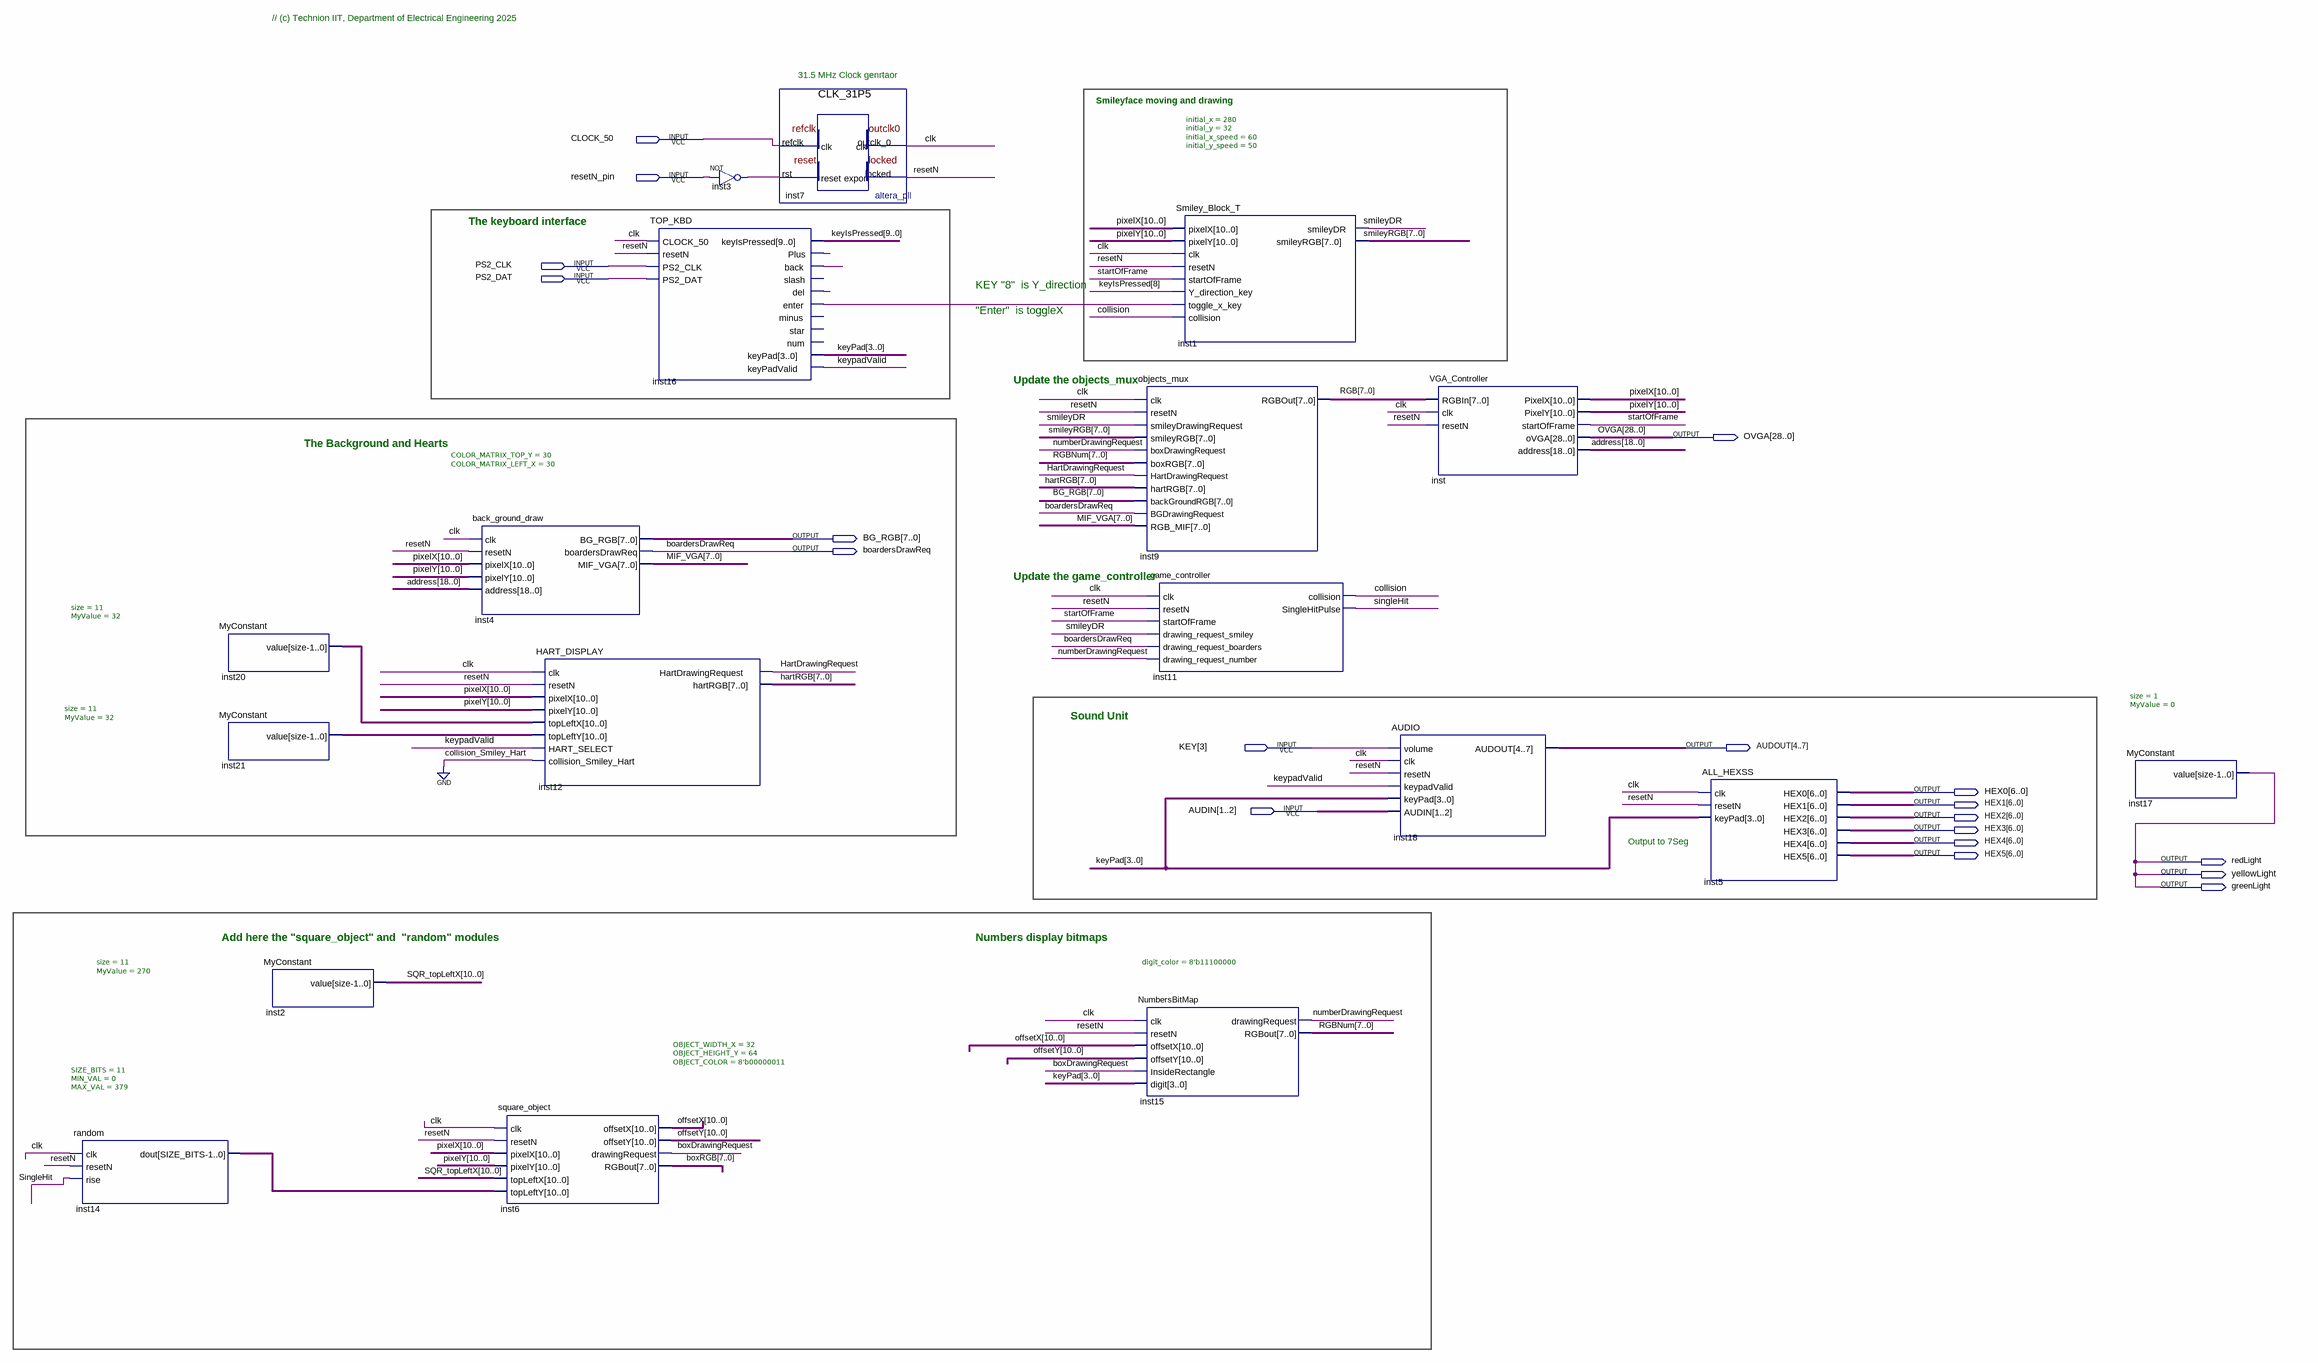
[diagram p0: schematic sheet]
// Quartus schematic TOP_VGA_DEMO.bdf as structural Verilog: 18 symbols, 19 pins
module TOP_VGA_DEMO (
  input  CLOCK_50,
  input  resetN_pin,
  input  PS2_CLK,
  input  PS2_DAT,
  input  [3:3] KEY,
  input  [1:2] AUDIN,
  output [28:0] OVGA,
  output [7:0] BG_RGB,
  output boardersDrawReq,
  output [4:7] AUDOUT,
  output [6:0] HEX0,
  output [6:0] HEX1,
  output [6:0] HEX2,
  output [6:0] HEX3,
  output [6:0] HEX4,
  output [6:0] HEX5,
  output redLight,
  output yellowLight,
  output greenLight
);

  wire boxDrawingRequest, clk, collision, HartDrawingRequest, inst3_out, inst16_back, inst16_del,
       inst16_enter, inst16_plus, keypadValid, numberDrawingRequest, resetN, singleHit, smileyDR,
       startOfFrame;
  wire [3:0] keyPad;
  wire [7:0] boxRGB, hartRGB, MIF_VGA, RGB, RGBNum, smileyRGB;
  wire [9:0] keyIsPressed;
  wire [10:0] inst14_dout, inst20_value, inst21_value, offsetX, offsetY, pixelX, pixelY, SQR_topLeftX;
  wire [18:0] address;

  random #(.SIZE_BITS(11), .MIN_VAL(0), .MAX_VAL(379)) inst14 (
    .clk(clk), .resetN(resetN), .rise(singleHit), .dout(inst14_dout));
  MyConstant #(.size(11), .MyValue(32)) inst20 (.value(inst20_value));
  MyConstant #(.size(11), .MyValue(32)) inst21 (.value(inst21_value));
  MyConstant #(.size(11), .MyValue(270)) inst2 (.value(SQR_topLeftX));
  back_ground_draw #(.COLOR_MATRIX_TOP_Y(30), .COLOR_MATRIX_LEFT_X(30)) inst4 (
    .clk(clk), .resetN(resetN), .pixelX(pixelX), .pixelY(pixelY), .address(address), .BG_RGB(BG_RGB),
    .boardersDrawReq(boardersDrawReq), .MIF_VGA(MIF_VGA));
  square_object #(.OBJECT_WIDTH_X(32), .OBJECT_HEIGHT_Y(64), .OBJECT_COLOR(8'b00000011)) inst6 (
    .clk(clk), .resetN(resetN), .pixelX(pixelX), .pixelY(pixelY), .topLeftX(SQR_topLeftX),
    .topLeftY(inst14_dout), .offsetX(offsetX), .offsetY(offsetY), .drawingRequest(boxDrawingRequest),
    .RGBout(boxRGB));
  HART_DISPLAY inst12 (
    .clk(clk), .resetN(resetN), .pixelX(pixelX), .pixelY(pixelY), .topLeftX(inst20_value),
    .topLeftY(inst21_value), .HART_SELECT(keypadValid), .collision_Smiley_Hart(1'b0),
    .HartDrawingRequest(HartDrawingRequest), .hartRGB(hartRGB));
  TOP_KBD inst16 (
    .CLOCK_50(clk), .resetN(resetN), .PS2_CLK(PS2_CLK), .PS2_DAT(PS2_DAT), .keyIsPressed(keyIsPressed),
    .Plus(inst16_plus), .back(inst16_back), .del(inst16_del), .enter(inst16_enter), .keyPad(keyPad),
    .keyPadValid(keypadValid));  // open: slash, minus, star, num
  not inst3 (inst3_out, resetN_pin);
  CLK_31P5 inst7 (.refclk(CLOCK_50), .rst(inst3_out), .outclk_0(clk), .locked(resetN));
  objects_mux inst9 (
    .clk(clk), .resetN(resetN), .smileyDrawingRequest(smileyDR), .smileyRGB(smileyRGB),
    .boxDrawingRequest(numberDrawingRequest), .boxRGB(RGBNum), .HartDrawingRequest(HartDrawingRequest),
    .hartRGB(hartRGB), .backGroundRGB(BG_RGB), .BGDrawingRequest(boardersDrawReq), .RGB_MIF(MIF_VGA),
    .RGBOut(RGB));
  game_controller inst11 (
    .clk(clk), .resetN(resetN), .startOfFrame(startOfFrame), .drawing_request_smiley(smileyDR),
    .drawing_request_boarders(boardersDrawReq), .drawing_request_number(numberDrawingRequest),
    .collision(collision), .SingleHitPulse(singleHit));
  NumbersBitMap #(.digit_color(8'b11100000)) inst15 (
    .clk(clk), .resetN(resetN), .offsetX(offsetX), .offsetY(offsetY), .InsideRectangle(boxDrawingRequest),
    .digit(keyPad), .drawingRequest(numberDrawingRequest), .RGBout(RGBNum));
  Smiley_Block_T #(.initial_x(280), .initial_y(32), .initial_x_speed(60), .initial_y_speed(50)) inst1 (
    .pixelX(pixelX), .pixelY(pixelY), .clk(clk), .resetN(resetN), .startOfFrame(startOfFrame),
    .Y_direction_key(keyIsPressed[8]), .toggle_x_key(inst16_enter), .collision(collision),
    .smileyDR(smileyDR), .smileyRGB(smileyRGB));
  AUDIO inst18 (
    .volume(KEY[3]), .clk(clk), .resetN(resetN), .keypadValid(keypadValid), .keyPad(keyPad), .AUDIN(AUDIN),
    .AUDOUT(AUDOUT));
  VGA_Controller inst (
    .RGBIn(RGB), .clk(clk), .resetN(resetN), .PixelX(pixelX), .PixelY(pixelY), .startOfFrame(startOfFrame),
    .oVGA(OVGA), .address(address));
  ALL_HEXSS inst5 (
    .clk(clk), .resetN(resetN), .keyPad(keyPad), .HEX0(HEX0), .HEX1(HEX1), .HEX2(HEX2), .HEX3(HEX3),
    .HEX4(HEX4), .HEX5(HEX5));
  MyConstant #(.size(1), .MyValue(0)) inst17 (.value(greenLight));

  assign redLight = greenLight;
  assign yellowLight = greenLight;

  // Notes on the sheet:
  //   // (c) Technion IIT, Department of Electrical Engineering 2025
  //   31.5 MHz Clock genrtaor
  //   Smileyface moving and drawing
  //   The keyboard interface
  //   KEY "8"  is Y_direction
  //   "Enter"  is toggleX
  //   Update the objects_mux
  //   The Background and Hearts
  //   Update the game_controller
  //   Sound Unit
  //   Output to 7Seg
  //   Add here the "square_object" and  "random" modules
  //   Numbers display bitmaps
endmodule
